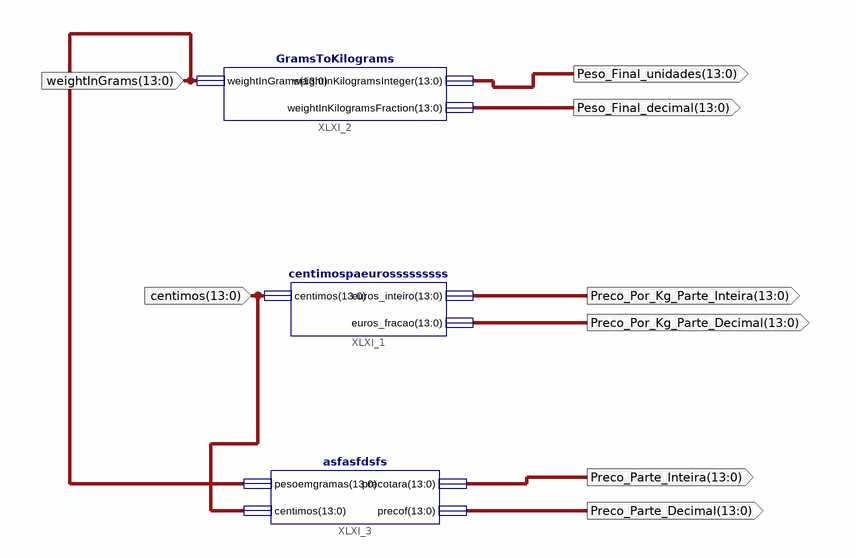
[diagram p0: schematic sheet 1]
// Xilinx ISE schematic projetosembcd.sch (artix7) as structural Verilog: 3 symbols, 8 ports
module projetosembcd (
  input  [13:0] weightInGrams,
  input  [13:0] centimos,
  output [13:0] Preco_Por_Kg_Parte_Inteira,
  output [13:0] Preco_Por_Kg_Parte_Decimal,
  output [13:0] Peso_Final_decimal,
  output [13:0] Preco_Parte_Decimal,
  output [13:0] Preco_Parte_Inteira,
  output [13:0] Peso_Final_unidades
);

  centimospaeurosssssssss XLXI_1 (
    .centimos(centimos), .euros_inteiro(Preco_Por_Kg_Parte_Inteira), .euros_fracao(Preco_Por_Kg_Parte_Decimal));
  GramsToKilograms XLXI_2 (
    .weightInGrams(weightInGrams), .weightInKilogramsInteger(Peso_Final_unidades),
    .weightInKilogramsFraction(Peso_Final_decimal));
  asfasfdsfs XLXI_3 (
    .pesoemgramas(weightInGrams), .centimos(centimos), .precotara(Preco_Parte_Inteira),
    .precof(Preco_Parte_Decimal));
endmodule
